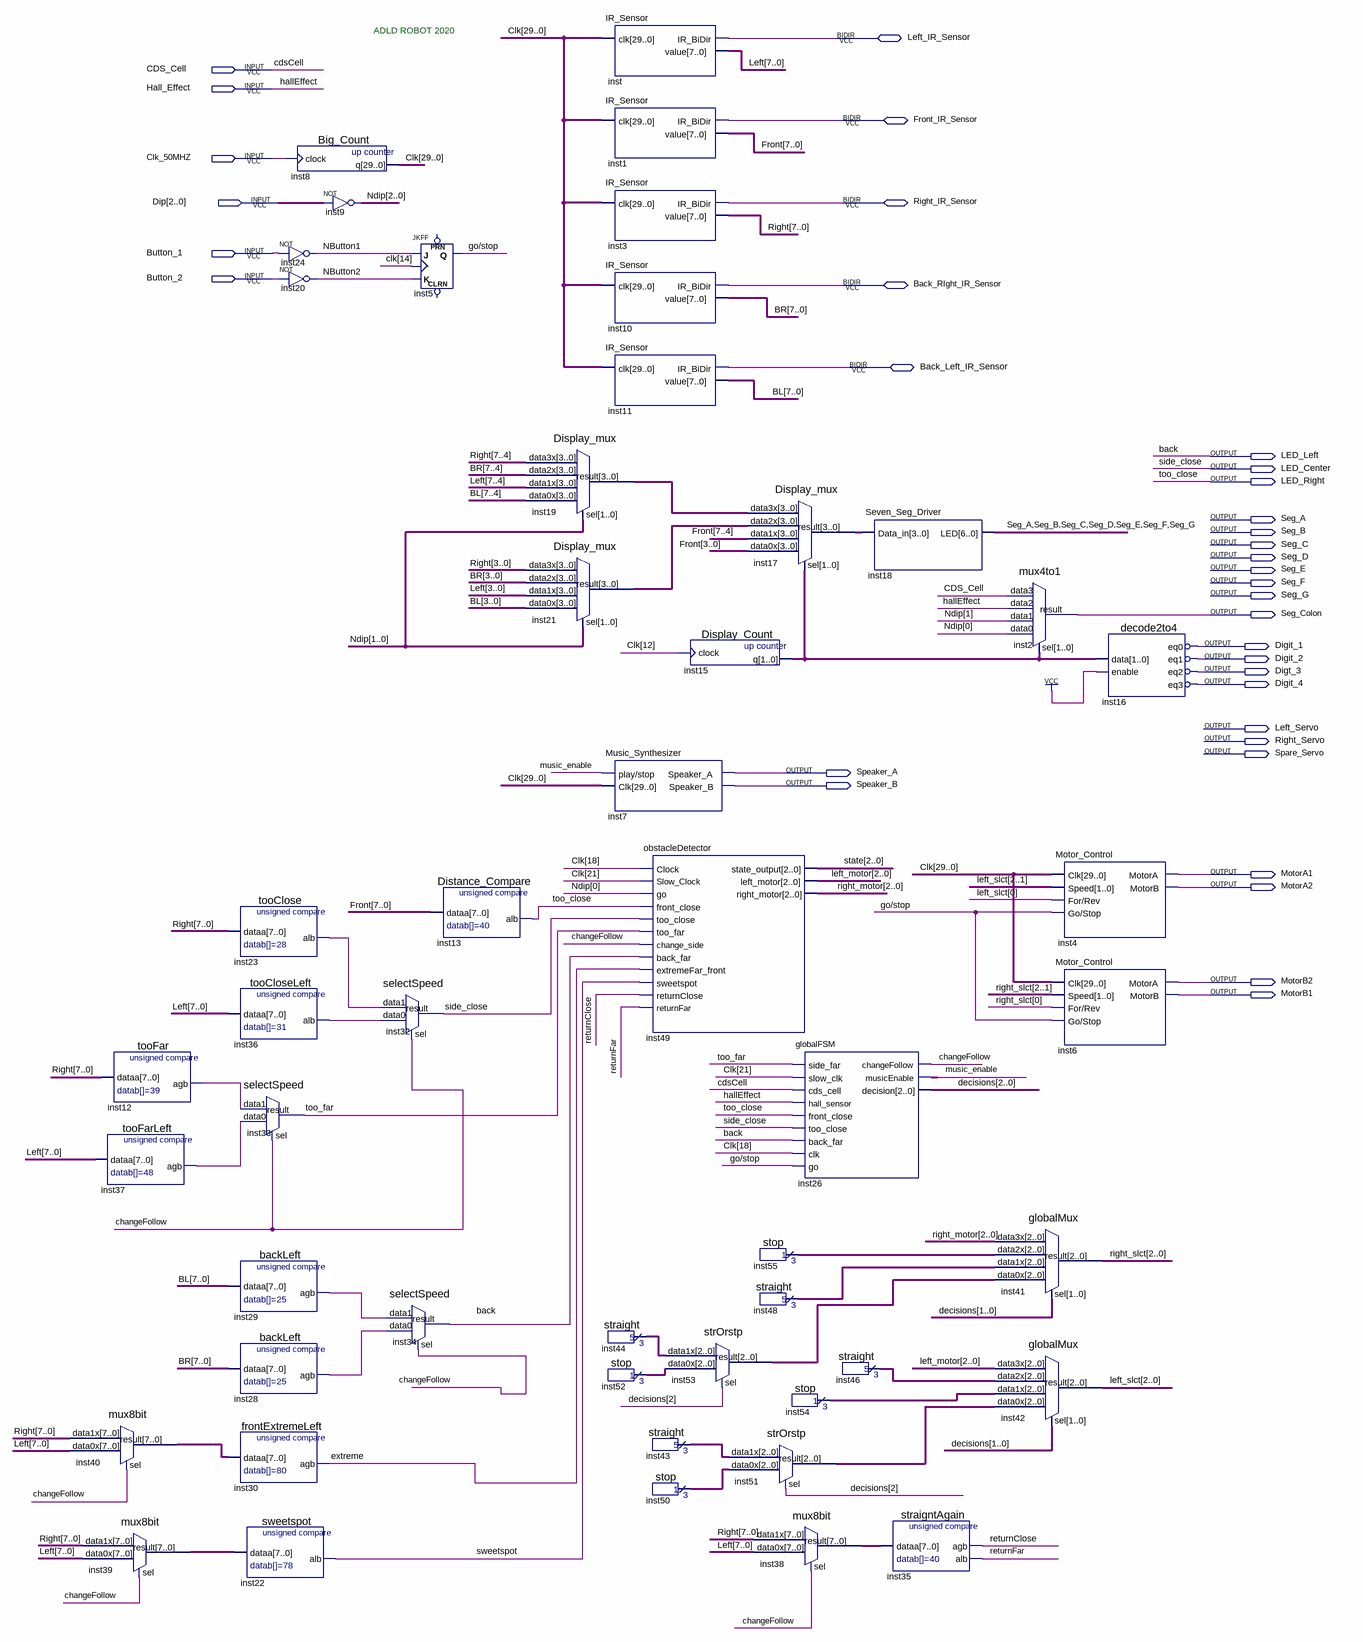
[diagram p0: schematic sheet]
// Quartus schematic Main.bdf as structural Verilog: 50 symbols, 35 pins
module Main (
  input  CDS_Cell,
  input  Hall_Effect,
  input  Clk_50MHZ,
  input  [2:0] Dip,
  input  Button_1,
  input  Button_2,
  inout  Left_IR_Sensor,
  inout  Front_IR_Sensor,
  inout  Right_IR_Sensor,
  inout  Back_RIght_IR_Sensor,
  inout  Back_Left_IR_Sensor,
  output LED_Left,
  output LED_Center,
  output LED_Right,
  output Seg_A,
  output Seg_B,
  output Seg_C,
  output Seg_D,
  output Seg_E,
  output Seg_F,
  output Seg_G,
  output Seg_Colon,
  output Digit_1,
  output Digit_2,
  output Digt_3,
  output Digit_4,
  output Left_Servo,
  output Right_Servo,
  output Spare_Servo,
  output Speaker_A,
  output Speaker_B,
  output MotorA1,
  output MotorA2,
  output MotorB2,
  output MotorB1
);

  wire changeFollow, extreme, \go/stop , inst12_agb, inst16_eq0, inst16_eq1, inst16_eq2, inst16_eq3,
       inst23_alb, inst26_musicenable, inst28_agb, inst29_agb, inst36_alb, inst37_agb, music_enable,
       NButton1, NButton2, returnClose, returnFar, sweetspot, too_far;
  wire [1:0] inst15_q;
  wire [2:0] decisions, inst43_result, inst44_result, inst46_result, inst48_result, inst50_result,
       inst51_result, inst52_result, inst53_result, inst54_result, inst55_result, left_motor, left_slct,
       Ndip, right_motor, right_slct, state;
  wire [3:0] inst17_result, inst19_result, inst21_result;
  wire [7:0] BL, BR, Front, inst38_result, inst39_result, inst40_result, Left, Right;
  wire [29:0] Clk;

  mux8bit inst40 (.data1x(Right), .data0x(Left), .sel(changeFollow), .result(inst40_result));
  tooFar inst12 (.dataa(Right), .agb(inst12_agb));
  tooFarLeft inst37 (.dataa(Left), .agb(inst37_agb));
  mux8bit inst39 (.data1x(Right), .data0x(Left), .sel(changeFollow), .result(inst39_result));
  tooClose inst23 (.dataa(Right), .alb(inst23_alb));
  tooCloseLeft inst36 (.dataa(Left), .alb(inst36_alb));
  selectSpeed inst33 (.data1(inst12_agb), .data0(inst37_agb), .sel(changeFollow), .result(too_far));
  backLeft inst29 (.dataa(BL), .agb(inst29_agb));
  backLeft inst28 (.dataa(BR), .agb(inst28_agb));
  frontExtremeLeft inst30 (.dataa(inst40_result), .agb(extreme));
  sweetspot inst22 (.dataa(inst39_result), .alb(sweetspot));
  Big_Count inst8 (.clock(Clk_50MHZ), .q(Clk));
  assign Ndip = ~Dip;  // NOT inst9, 3 bits wide
  not inst24 (NButton1, Button_1);
  not inst20 (NButton2, Button_2);
  JKFF inst5 (.K(NButton2), .J(NButton1), .CLK(Clk[14]), .Q(\go/stop ));  // open: PRN, CLRN
  selectSpeed inst32 (.data1(inst23_alb), .data0(inst36_alb), .sel(changeFollow), .result(LED_Center));
  selectSpeed inst34 (.data1(inst29_agb), .data0(inst28_agb), .sel(changeFollow), .result(LED_Left));
  Distance_Compare inst13 (.dataa(Front), .alb(LED_Right));
  Display_mux inst19 (
    .data3x(Right[7:4]), .data2x(BR[7:4]), .data1x(Left[7:4]), .data0x(BL[7:4]), .sel(Ndip[1:0]),
    .result(inst19_result));
  Display_mux inst21 (
    .data3x(Right[3:0]), .data2x(BR[3:0]), .data1x(Left[3:0]), .data0x(BL[3:0]), .sel(Ndip[1:0]),
    .result(inst21_result));
  IR_Sensor inst (.clk(Clk), .value(Left), .IR_BiDir(Left_IR_Sensor));
  IR_Sensor inst1 (.clk(Clk), .value(Front), .IR_BiDir(Front_IR_Sensor));
  IR_Sensor inst3 (.clk(Clk), .value(Right), .IR_BiDir(Right_IR_Sensor));
  IR_Sensor inst10 (.clk(Clk), .value(BR), .IR_BiDir(Back_RIght_IR_Sensor));
  IR_Sensor inst11 (.clk(Clk), .value(BL), .IR_BiDir(Back_Left_IR_Sensor));
  Music_Synthesizer inst7 (.\play/stop (music_enable), .Clk(Clk), .Speaker_A(Speaker_A), .Speaker_B(Speaker_B));
  straight inst44 (.result(inst44_result));
  stop inst52 (.result(inst52_result));
  Display_Count inst15 (.clock(Clk[12]), .q(inst15_q));
  obstacleDetector inst49 (
    .Clock(Clk[18]), .Slow_Clock(Clk[21]), .go(Ndip[0]), .front_close(LED_Right), .too_close(LED_Center),
    .too_far(too_far), .change_side(changeFollow), .back_far(LED_Left), .extremeFar_front(extreme),
    .sweetspot(sweetspot), .returnClose(returnClose), .returnFar(returnFar), .state_output(state),
    .left_motor(left_motor), .right_motor(right_motor));
  strOrstp inst53 (.data1x(inst44_result), .data0x(inst52_result), .sel(decisions[2]), .result(inst53_result));
  straight inst43 (.result(inst43_result));
  stop inst50 (.result(inst50_result));
  strOrstp inst51 (.data1x(inst43_result), .data0x(inst50_result), .sel(decisions[2]), .result(inst51_result));
  Display_mux inst17 (
    .data3x(inst19_result), .data2x(inst21_result), .data1x(Front[7:4]), .data0x(Front[3:0]), .sel(inst15_q),
    .result(inst17_result));
  stop inst55 (.result(inst55_result));
  straight inst48 (.result(inst48_result));
  stop inst54 (.result(inst54_result));
  mux8bit inst38 (.data1x(Right), .data0x(Left), .sel(changeFollow), .result(inst38_result));
  globalFSM inst26 (
    .side_far(too_far), .slow_clk(Clk[21]), .cds_cell(CDS_Cell), .hall_sensor(Hall_Effect),
    .front_close(LED_Right), .too_close(LED_Center), .back_far(LED_Left), .clk(Clk[18]), .go(\go/stop ),
    .changeFollow(changeFollow), .musicEnable(inst26_musicenable), .decision(decisions));
  straight inst46 (.result(inst46_result));
  Seven_Seg_Driver inst18 (.Data_in(inst17_result), .LED({Seg_A, Seg_B, Seg_C, Seg_D, Seg_E, Seg_F, Seg_G}));
  straigntAgain inst35 (.dataa(inst38_result), .agb(returnClose), .alb(returnFar));
  mux4to1 inst2 (
    .data3(CDS_Cell), .data2(Hall_Effect), .data1(Ndip[1]), .data0(Ndip[0]), .sel(inst15_q),
    .result(Seg_Colon));
  globalMux inst41 (
    .data3x(right_motor), .data2x(inst55_result), .data1x(inst48_result), .data0x(inst53_result),
    .sel(decisions[1:0]), .result(right_slct));
  globalMux inst42 (
    .data3x(left_motor), .data2x(inst46_result), .data1x(inst54_result), .data0x(inst51_result),
    .sel(decisions[1:0]), .result(left_slct));
  Motor_Control inst4 (
    .Clk(Clk), .Speed(left_slct[2:1]), .\For/Rev (left_slct[0]), .\Go/Stop (\go/stop ), .MotorA(MotorA1),
    .MotorB(MotorA2));
  Motor_Control inst6 (
    .Clk(Clk), .Speed(right_slct[2:1]), .\For/Rev (right_slct[0]), .\Go/Stop (\go/stop ), .MotorA(MotorB2),
    .MotorB(MotorB1));
  decode2to4 inst16 (
    .data(inst15_q), .enable(1'b1), .eq0(inst16_eq0), .eq1(inst16_eq1), .eq2(inst16_eq2), .eq3(inst16_eq3));
  not inst16_eq0_inverted (Digit_1, inst16_eq0);
  not inst16_eq1_inverted (Digit_2, inst16_eq1);
  not inst16_eq2_inverted (Digt_3, inst16_eq2);
  not inst16_eq3_inverted (Digit_4, inst16_eq3);

  // Other names for the same wires on the sheet: back = LED_Left; cdsCell = CDS_Cell; hallEffect = Hall_Effect;
  //   side_close = LED_Center; too_close = LED_Right

  // Notes on the sheet:
  //   ADLD ROBOT 2020
endmodule
